# Altium schematic sheet 20_Torq.SchDoc
size A3; SheetNumber: 3; SheetTotal: 12
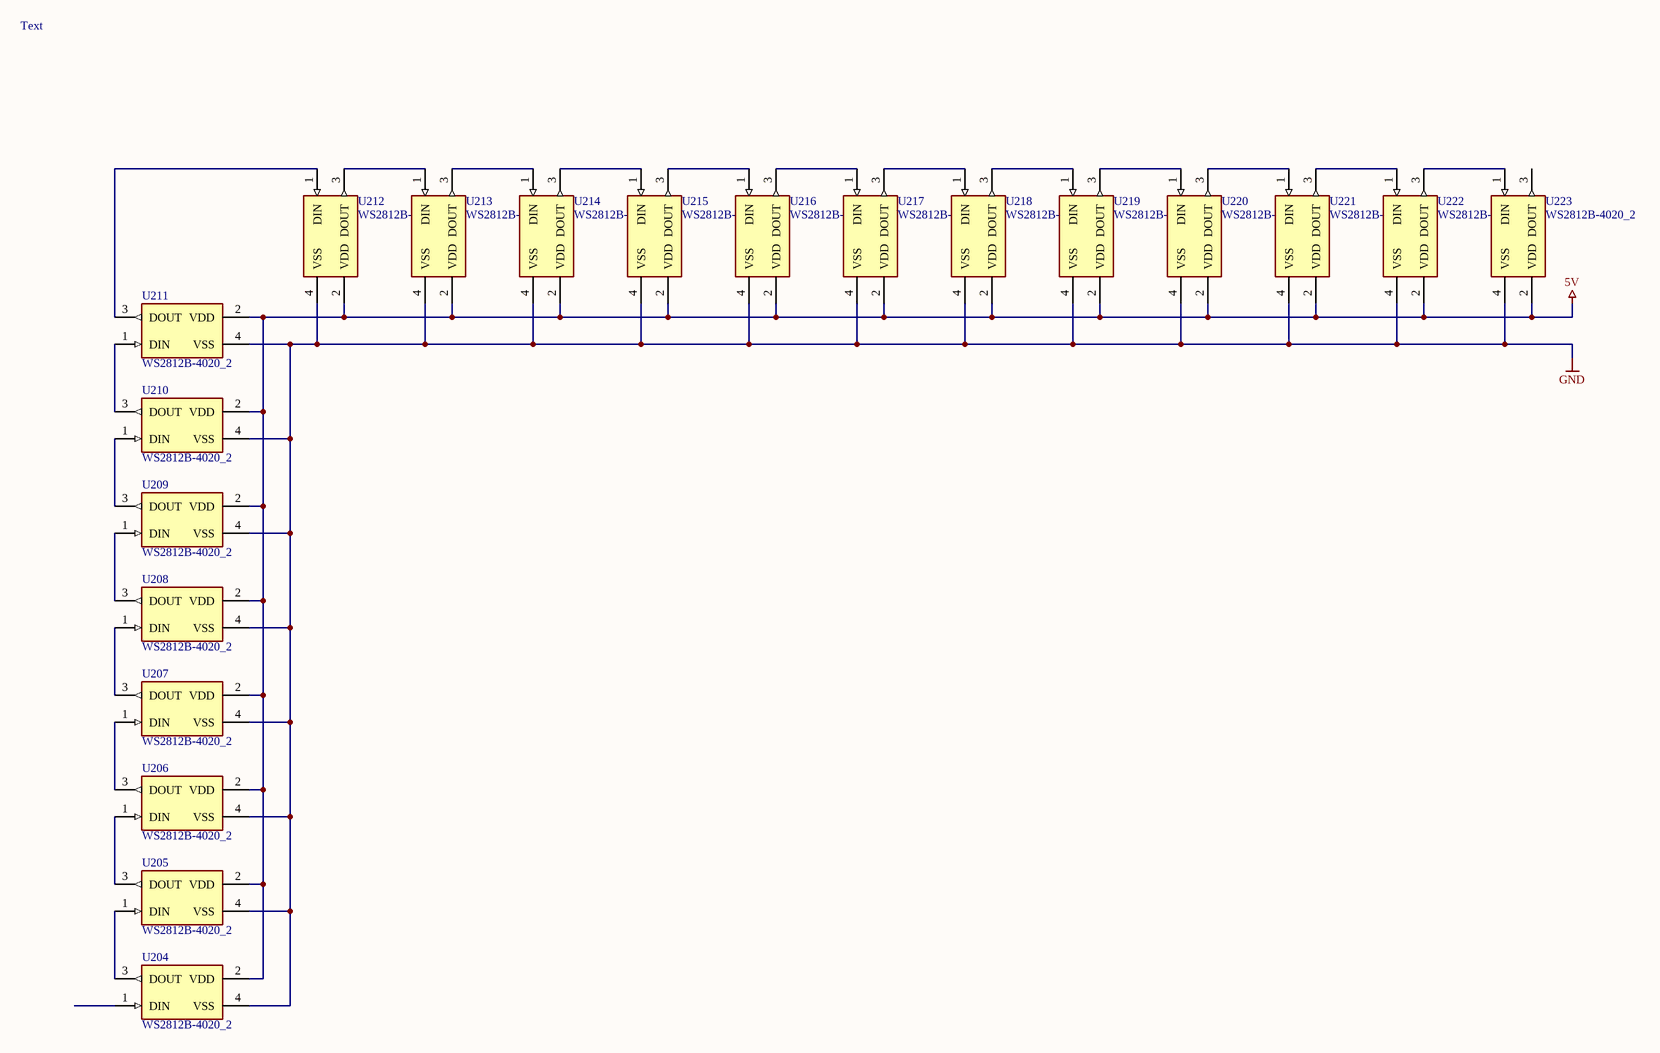
[diagram p0: 20_Torq.SchDoc]

## Parts
U204  WS2812B-4020_2  [LED_WS2812B-4020]
U205  WS2812B-4020_2  [LED_WS2812B-4020]
U206  WS2812B-4020_2  [LED_WS2812B-4020]
U207  WS2812B-4020_2  [LED_WS2812B-4020]
U208  WS2812B-4020_2  [LED_WS2812B-4020]
U209  WS2812B-4020_2  [LED_WS2812B-4020]
U210  WS2812B-4020_2  [LED_WS2812B-4020]
U211  WS2812B-4020_2  [LED_WS2812B-4020]
U212  WS2812B-4020_2  [LED_WS2812B-4020]
U213  WS2812B-4020_2  [LED_WS2812B-4020]
U214  WS2812B-4020_2  [LED_WS2812B-4020]
U215  WS2812B-4020_2  [LED_WS2812B-4020]
U216  WS2812B-4020_2  [LED_WS2812B-4020]
U217  WS2812B-4020_2  [LED_WS2812B-4020]
U218  WS2812B-4020_2  [LED_WS2812B-4020]
U219  WS2812B-4020_2  [LED_WS2812B-4020]
U220  WS2812B-4020_2  [LED_WS2812B-4020]
U221  WS2812B-4020_2  [LED_WS2812B-4020]
U222  WS2812B-4020_2  [LED_WS2812B-4020]
U223  WS2812B-4020_2  [LED_WS2812B-4020]

## Nets
5V: U204.2(VDD) U205.2(VDD) U206.2(VDD) U207.2(VDD) U208.2(VDD) U209.2(VDD) U210.2(VDD) U211.2(VDD) U212.2(VDD) U213.2(VDD) U214.2(VDD) U215.2(VDD) U216.2(VDD) U217.2(VDD) U218.2(VDD) U219.2(VDD) U220.2(VDD) U221.2(VDD) U222.2(VDD) U223.2(VDD)
GND: U204.4(VSS) U205.4(VSS) U206.4(VSS) U207.4(VSS) U208.4(VSS) U209.4(VSS) U210.4(VSS) U211.4(VSS) U212.4(VSS) U213.4(VSS) U214.4(VSS) U215.4(VSS) U216.4(VSS) U217.4(VSS) U218.4(VSS) U219.4(VSS) U220.4(VSS) U221.4(VSS) U222.4(VSS) U223.4(VSS)
NetU204_3: U204.3(DOUT) U205.1(DIN)
NetU205_3: U205.3(DOUT) U206.1(DIN)
NetU206_3: U206.3(DOUT) U207.1(DIN)
NetU207_3: U207.3(DOUT) U208.1(DIN)
NetU208_3: U208.3(DOUT) U209.1(DIN)
NetU209_3: U209.3(DOUT) U210.1(DIN)
NetU210_3: U210.3(DOUT) U211.1(DIN)
NetU211_3: U211.3(DOUT) U212.1(DIN)
NetU212_3: U212.3(DOUT) U213.1(DIN)
NetU213_3: U213.3(DOUT) U214.1(DIN)
NetU214_3: U214.3(DOUT) U215.1(DIN)
NetU215_3: U215.3(DOUT) U216.1(DIN)
NetU216_3: U216.3(DOUT) U217.1(DIN)
NetU217_3: U217.3(DOUT) U218.1(DIN)
NetU218_3: U218.3(DOUT) U219.1(DIN)
NetU219_3: U219.3(DOUT) U220.1(DIN)
NetU220_3: U220.3(DOUT) U221.1(DIN)
NetU221_3: U221.3(DOUT) U222.1(DIN)
NetU222_3: U222.3(DOUT) U223.1(DIN)

Not connected (* = marked no-connect by the designer): U204 1(DIN); U223 3(DOUT)

## Notes on the sheet
- Text

## Library data of the parts
U204-U223 = WS2812B-4020_2: 12mA RGB SMD,2x4mm Light Emitting Diodes; MF: Worldsemi; Price: None; MP: WS2812B-4020; Availability: Not in stock; SnapEDA_Link: https://www.snapeda.com/parts/WS2812B-4020/Worldsemi/view-part/?ref=snap; Check_prices: https://www.snapeda.com/parts/WS2812B-4020/Worldsemi/view-part/?ref=eda; Value: *; Package: Package